# EasyEDA schematic 1-Schematic_LEDmatrix.json
TITLE: Matrix Control and Power; REV: 1.0; Date: 2019-07-19; Sheet: 1/1; Drawn By: pgrayb; Company: Your Company
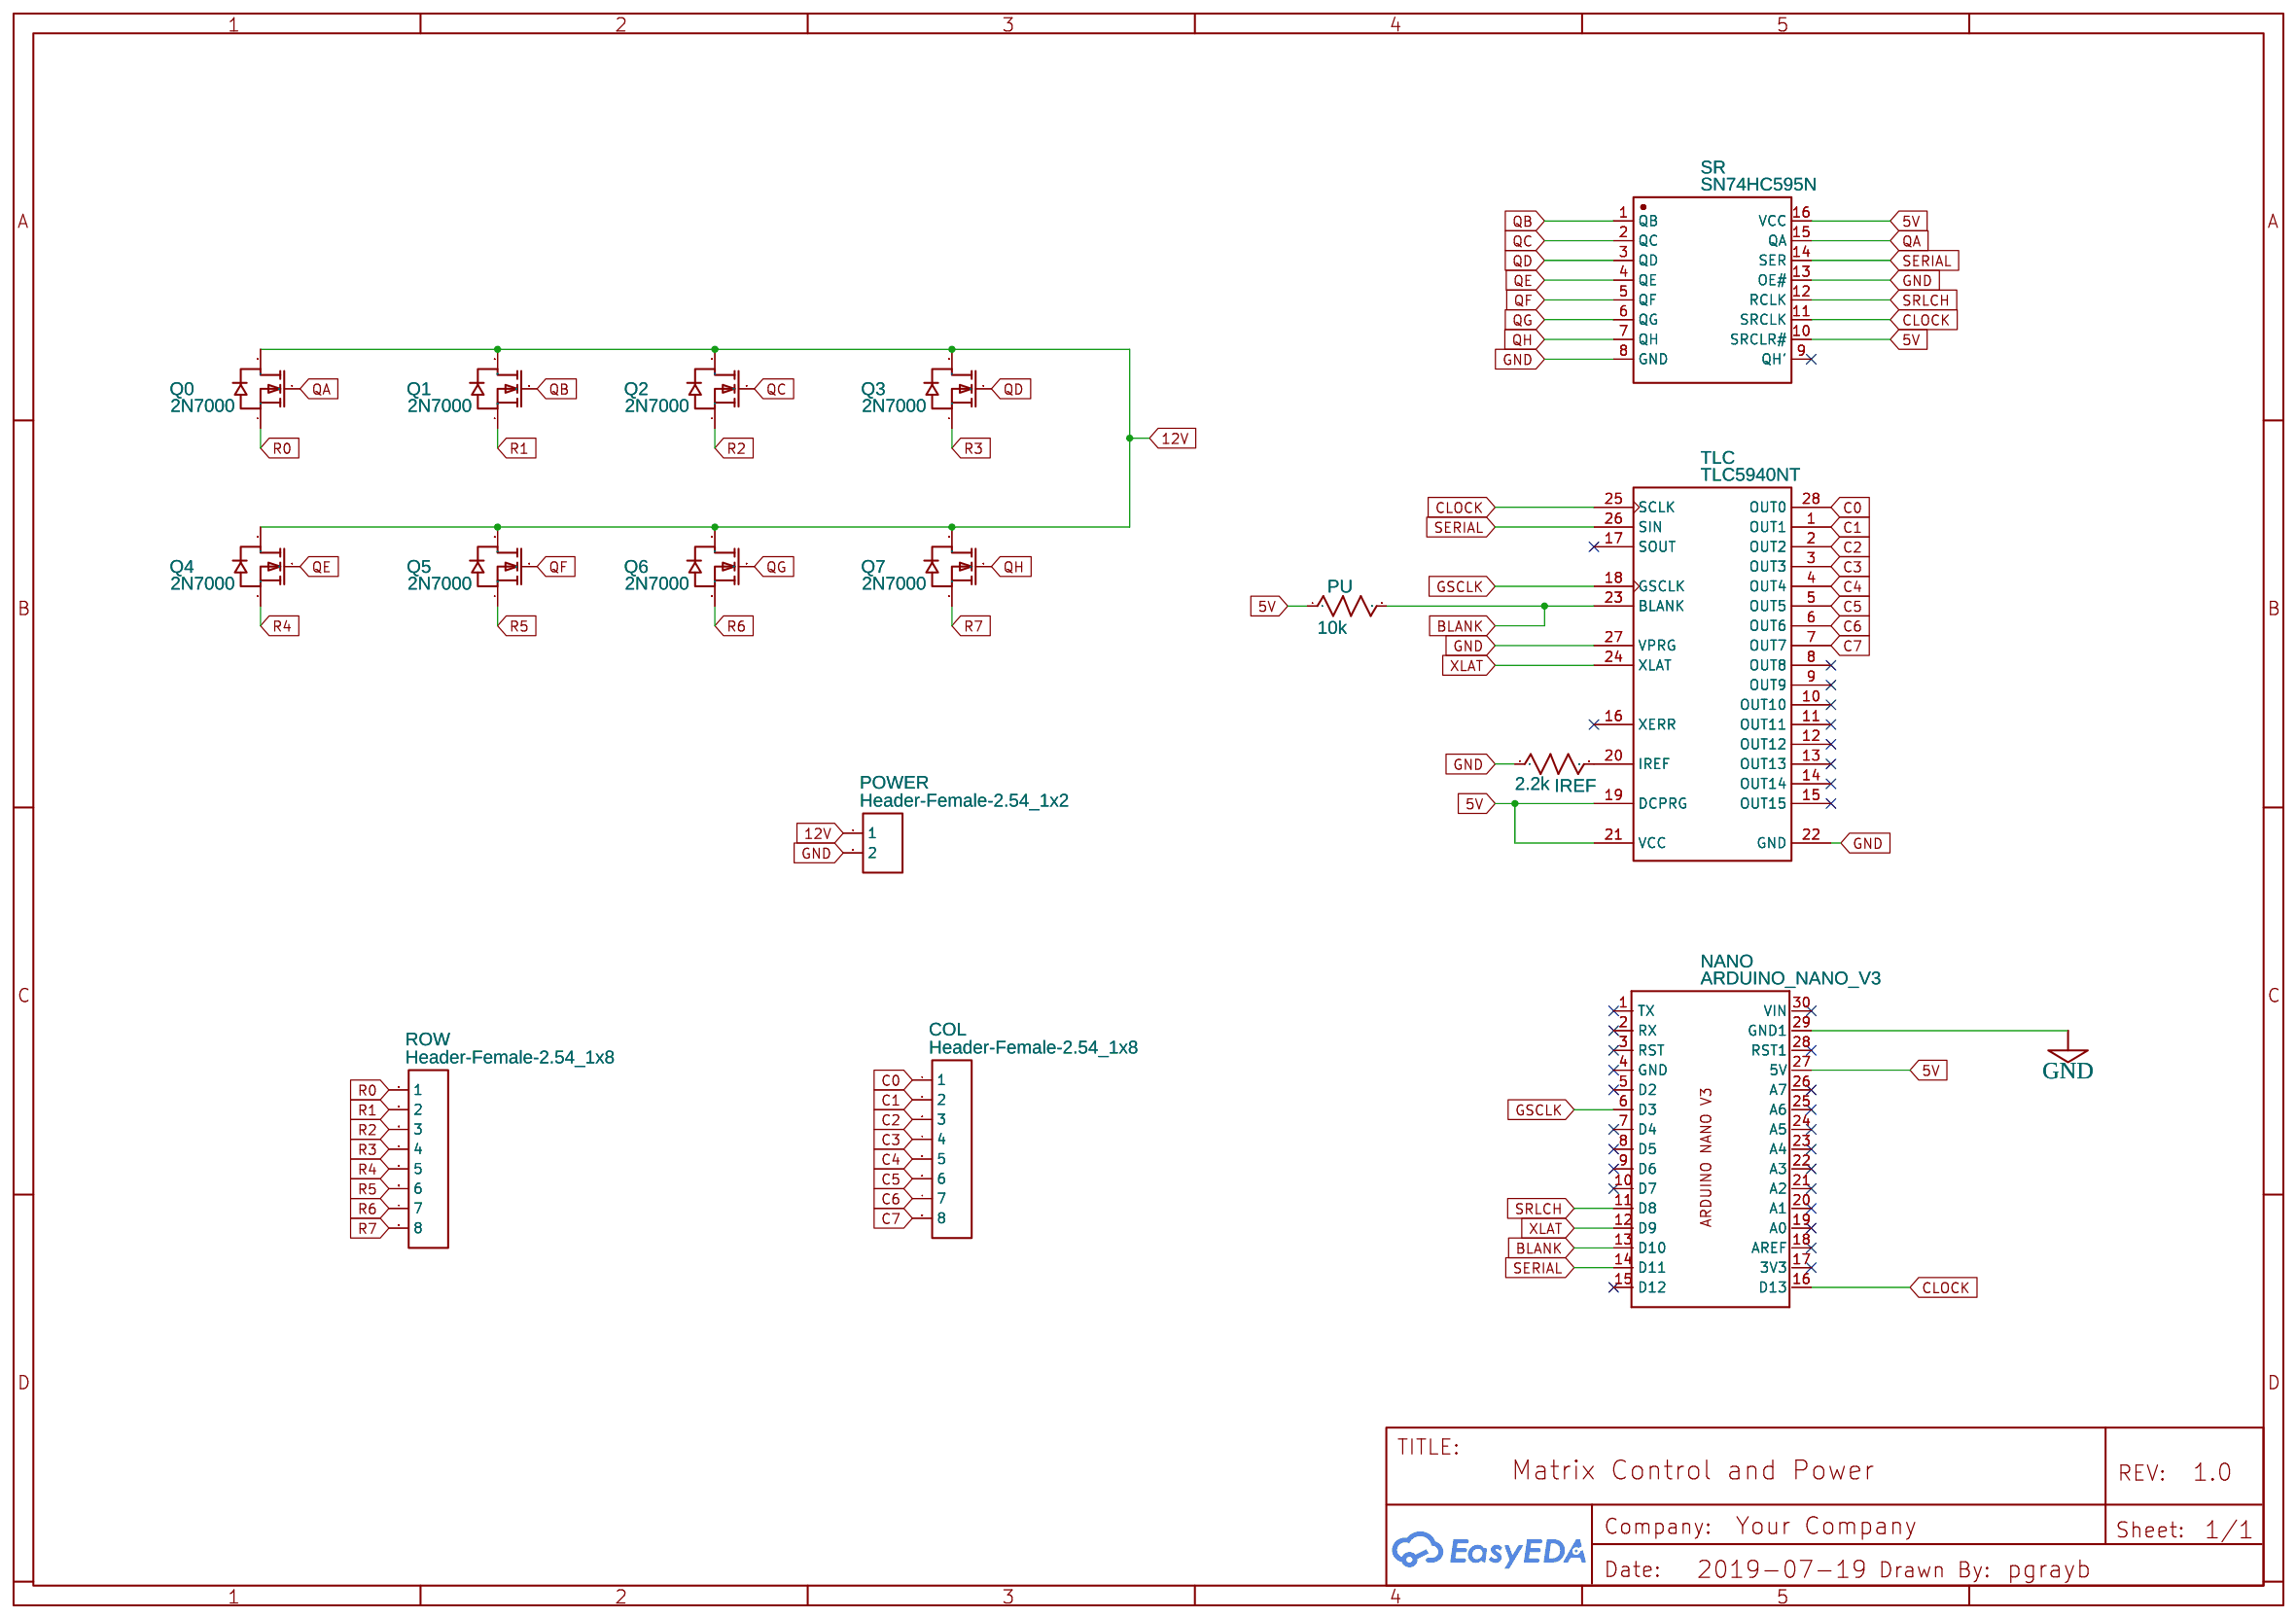
[diagram p0: schematic sheet]

## Parts
COL  Header-Female-2.54_1x8  [HDR-8X1/2.54]
IREF  2.2k  [AXIAL-0.3]
NANO  ARDUINO_NANO_V3  [DIP30_NANO]
POWER  Header-Female-2.54_1x2  [HDR-1X2/2.54]
PU  10k  [AXIAL-0.3]
Q0  2N7000  [TO-92(TO-92-3)]
Q1  2N7000  [TO-92(TO-92-3)]
Q2  2N7000  [TO-92(TO-92-3)]
Q3  2N7000  [TO-92(TO-92-3)]
Q4  2N7000  [TO-92(TO-92-3)]
Q5  2N7000  [TO-92(TO-92-3)]
Q6  2N7000  [TO-92(TO-92-3)]
Q7  2N7000  [TO-92(TO-92-3)]
ROW  Header-Female-2.54_1x8  [HDR-8X1/2.54]
SR  SN74HC595N  [DIP-16]
TLC  TLC5940NT  [DIP28]

## Library data of the parts
COL ROW = -: Supplier: LCSC; Manufacturer: BOOMELE; Manufacturer Part: Female headerHDR1X8-2.54; Supplier Part: C27438
IREF = Res_AXIAL-0.3(1/8W)_US: Manufacturer Part: ?
NANO = -: Contributor: vndtiger; Manufacturer Part: ?
POWER = -: Supplier: LCSC; Manufacturer: BOOMELE; Manufacturer Part: 2.54-1*2PFemale; image: //image.lceda.cn/szlcsc/C49661.jpg; Supplier Part: C49661
PU = Res_AXIAL-0.3(1/8W)_US: Manufacturer Part: ?; Package Display: No
Q0-Q7 = -: Supplier: LCSC; Manufacturer: CJ; image: //image.lceda.cn/szlcsc/C9114.jpg; Supplier Part: C9114
SR = -: Supplier: LCSC; Manufacturer: TI; image: //image.lceda.cn/szlcsc/C78711.jpg; Supplier Part: C78711
TLC = -: 16-Channel LED Driver with EEprom DOT Correction  Grayscale PWM Control, 3 to 5.5 V, -40 to 85 degC, 28-pin DIP (NT28), Green (RoHS  no SbBr); Manufacturer Part: ?

## Nets
5V: NANO.27(5V) PU.1 SR.10(SRCLR#) SR.16(VCC) TLC.19(DCPRG) TLC.21(VCC)
12V: POWER.1 Q0.3(D) Q1.3(D) Q2.3(D) Q3.3(D) Q4.3(D) Q5.3(D) Q6.3(D) Q7.3(D)
GND: IREF.1 NANO.29(GND1) POWER.2 SR.8(GND) SR.13(OE#) TLC.22(GND) TLC.27(VPRG)
BLANK: NANO.13(D10) PU.2 TLC.23(BLANK)
C0: COL.1 TLC.28(OUT0)
C1: COL.2 TLC.1(OUT1)
C2: COL.3 TLC.2(OUT2)
C3: COL.4 TLC.3(OUT3)
C4: COL.5 TLC.4(OUT4)
C5: COL.6 TLC.5(OUT5)
C6: COL.7 TLC.6(OUT6)
C7: COL.8 TLC.7(OUT7)
CLOCK: NANO.16(D13) SR.11(SRCLK) TLC.25(SCLK)
GSCLK: NANO.6(D3) TLC.18(GSCLK)
QA: Q0.2(G) SR.15(QA)
QB: Q1.2(G) SR.1(QB)
QC: Q2.2(G) SR.2(QC)
QD: Q3.2(G) SR.3(QD)
QE: Q4.2(G) SR.4(QE)
QF: Q5.2(G) SR.5(QF)
QG: Q6.2(G) SR.6(QG)
QH: Q7.2(G) SR.7(QH)
R0: Q0.1(S) ROW.1
R1: Q1.1(S) ROW.2
R2: Q2.1(S) ROW.3
R3: Q3.1(S) ROW.4
R4: Q4.1(S) ROW.5
R5: Q5.1(S) ROW.6
R6: Q6.1(S) ROW.7
R7: Q7.1(S) ROW.8
SERIAL: NANO.14(D11) SR.14(SER) TLC.26(SIN)
SRLCH: NANO.11(D8) SR.12(RCLK)
XLAT: NANO.12(D9) TLC.24(XLAT)
Net-(IREF-2): IREF.2 TLC.20(IREF)

Not connected (* = marked no-connect by the designer): NANO 1(TX)* 2(RX)* 3(RST)* 4(GND)* 5(D2)* 7(D4)* 8(D5)* 9(D6)* 10(D7)* 15(D12)* 17(3V3)* 18(AREF)* 19(A0)* 20(A1)* 21(A2)* 22(A3)* 23(A4)* 24(A5)* 25(A6)* 26(A7)* 28(RST1)* 30(VIN)*; SR 9(QH')*; TLC 8(OUT8)* 9(OUT9)* 10(OUT10)* 11(OUT11)* 12(OUT12)* 13(OUT13)* 14(OUT14)* 15(OUT15)* 16(XERR)* 17(SOUT)*
